# Altium schematic sheet 控制器电路.SchDoc
size A3
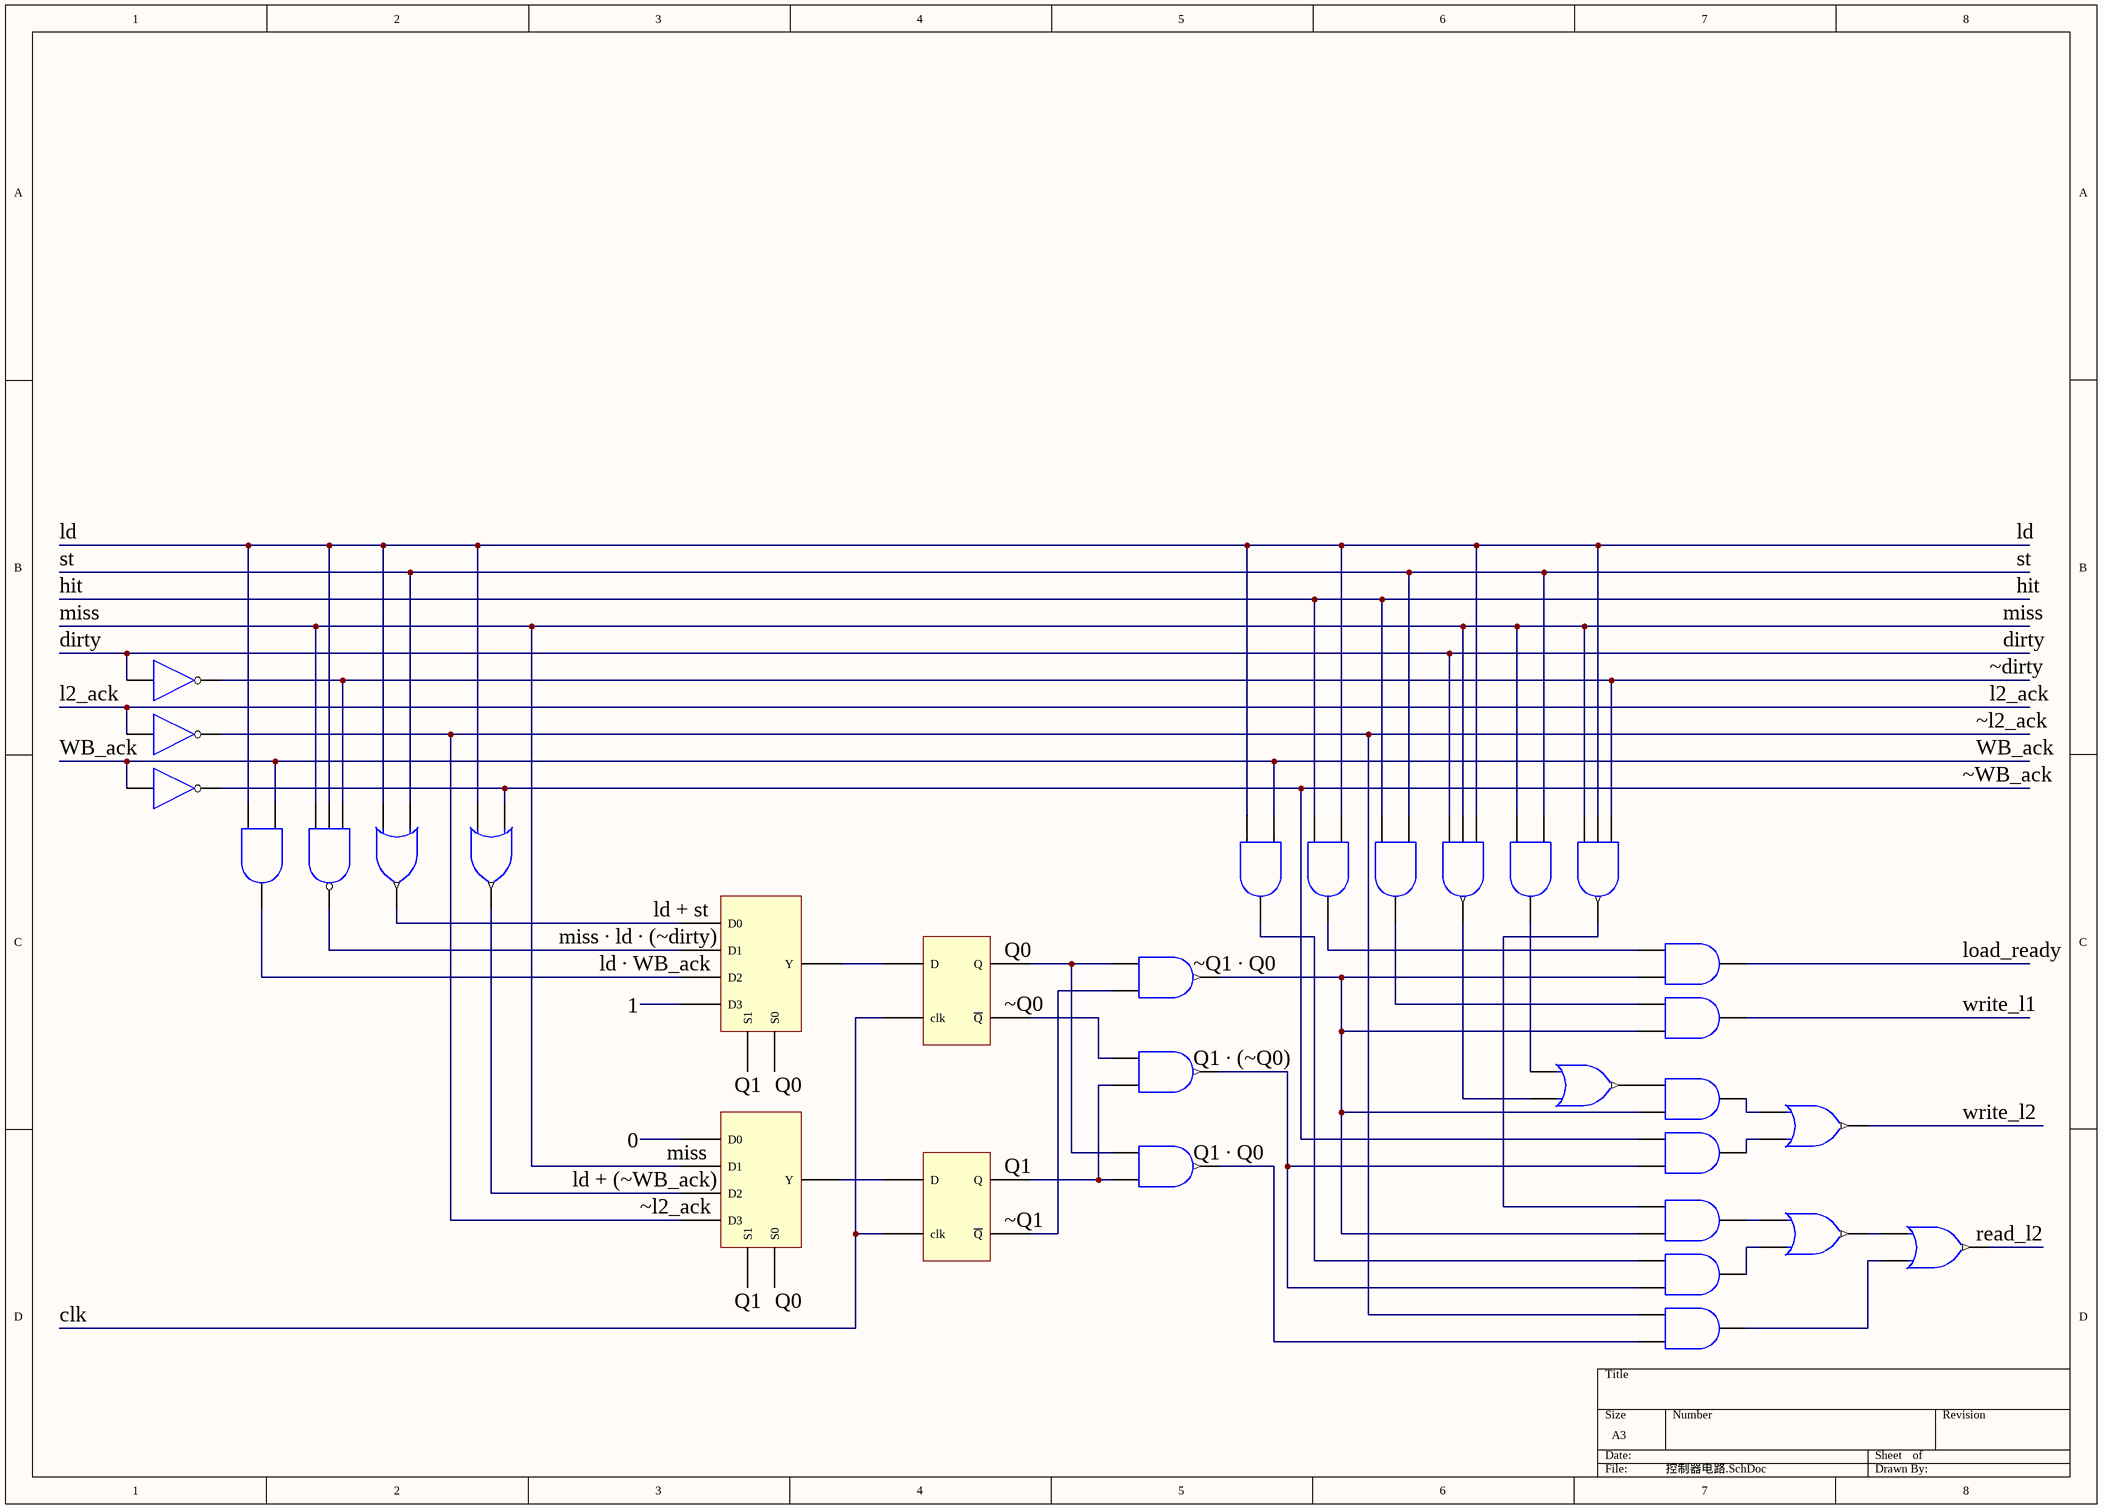
[diagram p0: 控制器电路.SchDoc]

## Parts
(Parts that share a designator on the sheet are numbered #1, #2 ... from top to bottom, then left to right.)
1  Mux  (value not drawn)
2  Mux  (value not drawn)
3  D_Register  (value not drawn)
4  D_Register  (value not drawn)
U1  74F10  [DIP-14]  (value not drawn)  (part A of 3)
U?#1  74F04  [DIP-14]  (value not drawn)  (part A of 6)
U?#2  74F04  [DIP-14]  (value not drawn)  (part A of 6)
U?#3  74F04  [DIP-14]  (value not drawn)  (part A of 6)
U?#4  74F08  [DIP-14]  (value not drawn)  (part A of 4)
U?#5  74F32  [DIP-14]  (value not drawn)  (part A of 4)
U?#6  74F32  [DIP-14]  (value not drawn)  (part A of 4)
U?#7  74F08  [DIP-14]  (value not drawn)  (part A of 4)
U?#8  74F08  [DIP-14]  (value not drawn)  (part A of 4)
U?#9  74F08  [DIP-14]  (value not drawn)  (part A of 4)
U?#10  74LS11  [DIP-14]  (value not drawn)  (part A of 3)
U?#11  74F08  [DIP-14]  (value not drawn)  (part A of 4)
U?#12  74LS11  [DIP-14]  (value not drawn)  (part A of 3)
U?#13  74F08  [DIP-14]  (value not drawn)  (part A of 4)
U?#14  74LS08  [DIP-14]  (value not drawn)  (part A of 4)
U?#15  74F08  [DIP-14]  (value not drawn)  (part A of 4)
U?#16  74LS08  [DIP-14]  (value not drawn)  (part A of 4)
U?#17  74F32  [DIP-14]  (value not drawn)  (part A of 4)
U?#18  74F08  [DIP-14]  (value not drawn)  (part A of 4)
U?#19  74F32  [DIP-14]  (value not drawn)  (part A of 4)
U?#20  74F08  [DIP-14]  (value not drawn)  (part A of 4)
U?#21  74LS08  [DIP-14]  (value not drawn)  (part A of 4)
U?#22  74F08  [DIP-14]  (value not drawn)  (part A of 4)
U?#23  74F32  [DIP-14]  (value not drawn)  (part A of 4)
U?#24  74F32  [DIP-14]  (value not drawn)  (part A of 4)
U?#25  74F08  [DIP-14]  (value not drawn)  (part A of 4)
U?#26  74F08  [DIP-14]  (value not drawn)  (part A of 4)

## Nets
GND: U1.7(GND) U?#1.7(GND) U?#2.7(GND) U?#3.7(GND) U?#4.7(GND) U?#5.7(GND) U?#6.7(GND) U?#7.7(GND) U?#8.7(GND) U?#9.7(GND) U?#10.7(GND) U?#11.7(GND) U?#12.7(GND) U?#13.7(GND) U?#14.7(GND) U?#15.7(GND) U?#16.7(GND) U?#17.7(GND) U?#18.7(GND) U?#19.7(GND) U?#20.7(GND) U?#21.7(GND) U?#22.7(GND) U?#23.7(GND) U?#24.7(GND) U?#25.7(GND) U?#26.7(GND)
VCC: U1.14(VCC) U?#1.14(VCC) U?#2.14(VCC) U?#3.14(VCC) U?#4.14(VCC) U?#5.14(VCC) U?#6.14(VCC) U?#7.14(VCC) U?#8.14(VCC) U?#9.14(VCC) U?#10.14(VCC) U?#11.14(VCC) U?#12.14(VCC) U?#13.14(VCC) U?#14.14(VCC) U?#15.14(VCC) U?#16.14(VCC) U?#17.14(VCC) U?#18.14(VCC) U?#19.14(VCC) U?#20.14(VCC) U?#21.14(VCC) U?#22.14(VCC) U?#23.14(VCC) U?#24.14(VCC) U?#25.14(VCC) U?#26.14(VCC)
Net1_0: 1.0(D0) U?#5.3(Y)
Net1_1: 1.1(D1) U1.12(Y)
Net1_1: 1.1(Y) 4.0(D)  [a separate net that carries the same name]
Net1_2: 1.2(D2) U?#4.3(Y)
Net2_1: 2.1(D1) U1.13(C) U?#10.2(B) U?#11.2(B) U?#12.13(C)
Net2_1: 2.1(Y) 3.0(D)  [a separate net that carries the same name]
Net2_2: 2.2(D2) U?#6.3(Y)
Net2_3: 2.3(D3) U?#2.2(Y) U?#26.1(A)
Net3_1: 3.1(clk) 4.1(clk)
Net3_2: 3.2(Q) U?#16.2(B) U?#21.2(B)
Net3_3: 3.3(~{Q}) U?#14.2(B)
Net4_2: 4.2(Q) U?#14.1(A) U?#21.1(A)
Net4_3: 4.3(~{Q}) U?#16.1(A)
NetU1_1: U1.1(A) U?#1.2(Y) U?#12.1(A)
NetU1_2: U1.2(B) U?#4.2(B) U?#5.2(B) U?#6.2(B) U?#7.2(B) U?#8.1(A) U?#10.1(A) U?#12.2(B)
NetU?#1_1: U?#1.1(A) U?#10.13(C)
NetU?#3_1: U?#3.1(A) U?#4.1(A) U?#7.1(A)
NetU?#3_2: U?#3.2(Y) U?#6.1(A) U?#20.1(A)
NetU?#5_1: U?#5.1(A) U?#9.1(A) U?#11.1(A)
NetU?#7_3: U?#7.3(Y) U?#25.1(A)
NetU?#8_2: U?#8.2(B) U?#9.2(B)
NetU?#8_3: U?#8.3(Y) U?#13.1(A)
NetU?#9_3: U?#9.3(Y) U?#15.1(A)
NetU?#10_12: U?#10.12(Y) U?#17.2(B)
NetU?#11_3: U?#11.3(Y) U?#17.1(A)
NetU?#12_12: U?#12.12(Y) U?#22.1(A)
NetU?#13_2: U?#13.2(B) U?#14.3(Y) U?#15.2(B) U?#18.2(B) U?#22.2(B)
NetU?#16_3: U?#16.3(Y) U?#20.2(B) U?#25.2(B)
NetU?#17_3: U?#17.3(Y) U?#18.1(A)
NetU?#18_3: U?#18.3(Y) U?#19.1(A)
NetU?#19_2: U?#19.2(B) U?#20.3(Y)
NetU?#21_3: U?#21.3(Y) U?#26.2(B)
NetU?#22_3: U?#22.3(Y) U?#23.1(A)
NetU?#23_2: U?#23.2(B) U?#25.3(Y)
NetU?#23_3: U?#23.3(Y) U?#24.1(A)
NetU?#24_2: U?#24.2(B) U?#26.3(Y)

Not connected (* = marked no-connect by the designer): 1 3(D3); 2 0(D0); U?#2 1(A); U?#13 3(Y); U?#15 3(Y); U?#19 3(Y); U?#24 3(Y)

## Notes on the sheet
- ld
- st
- hit
- miss
- (near U?#1) dirty
- dirty
- (near U?#1) l2_ack
- l2_ack
- ~dirty
- (near U?#2) WB_ack
- ~WB_ack
- WB_ack
- ~l2_ack
- (near 1) ld + st
- (near 1) miss · ld · (~dirty)
- (near 1) ld · WB_ack
- (near 4) Q0
- (near U?#14) ~Q1 · Q0
- load_ready
- 1
- (near 4) ~Q0
- write_l1
- Q1
- Q0
- (near U?#16) Q1 · (~Q0)
- write_l2
- (near 2) ld + (~WB_ack)
- 0
- (near 2) miss
- (near 3) Q1
- (near U?#21) Q1 · Q0
- (near 2) ~l2_ack
- (near 3) ~Q1
- (near U?#24) read_l2
- clk
- (near 2) Q1
- (near 2) Q0

## Library data of the parts
U1 = 74F10: Triple 3-Input Positive-NAND Gate
U?#1-U?#3 = 74F04: Hex Inverter
U?#4 U?#7-U?#9 U?#11 U?#13 U?#15 U?#18 U?#20 U?#22 U?#25 U?#26 = 74F08: Quad 2-Input Positive-AND Gate
U?#5 U?#6 U?#17 U?#19 U?#23 U?#24 = 74F32: Quad 2-Input Positive-OR Gate
U?#10 U?#12 = 74LS11: Triple 3-Input Positive-AND Gate
U?#14 U?#16 U?#21 = 74LS08: Quad 2-Input Positive-AND Gate